# Altium schematic sheet ESC_2S-5S.SchDoc: Brushless motor driver
size A4; Organization: Use Organization_Name in ProjParam; Address1: Eliot Ferragni; Address2: STI-MOBOTS; Address3: EPFL; Address4: CH-1015 LAUSANNE; DocumentNumber: 5; Revision: A; SheetNumber: 5; SheetTotal: 11; ApprovedBy: Init ApprovedBy in DocParam; CheckedBy: Init CheckedBy in DocParam; Author: Init Author in DocParam; CompanyName: Init CompanyName in DocParam; DrawnBy: Init DrawBy in DocParam; Engineer: Init Engineer in DocParam; Title2: Half-bridges + phase sense circuit + connector; DocumentName: Init DocumentName in DocParam; ProjectName: Init ProjectName in DocParam
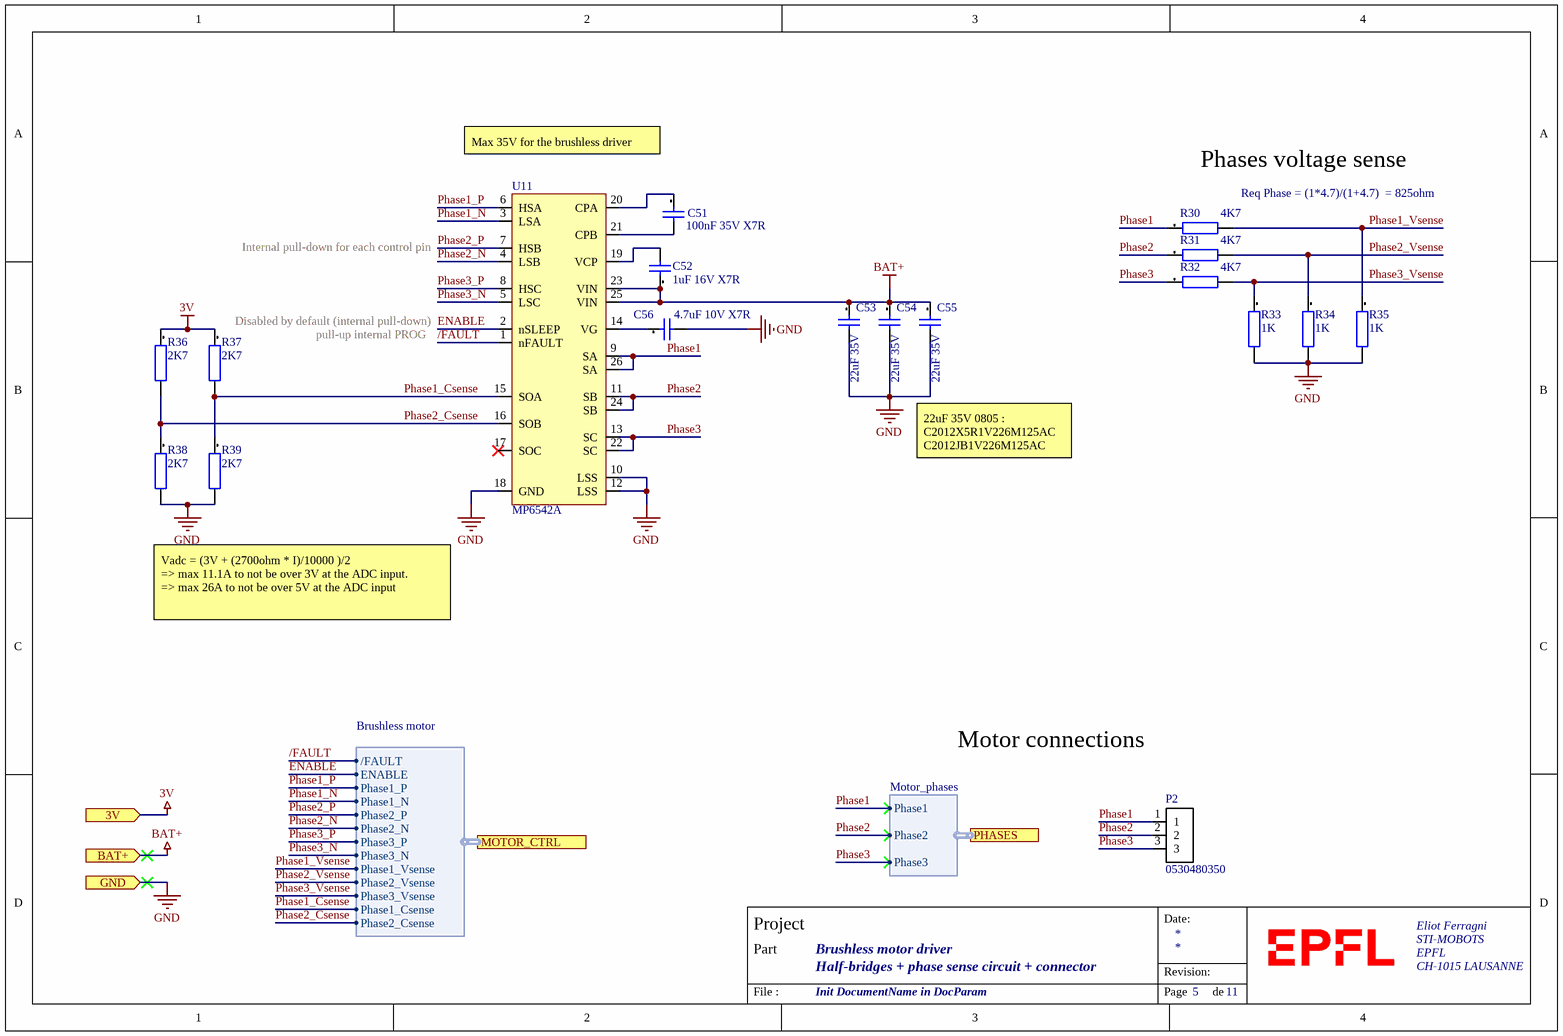
[diagram p0: ESC_2S-5S.SchDoc]

## Parts
C51  100nF 35V X7R  [CAPC1005X05L]
C52  1uF 16V X7R  [CAPC1608X08L]
C53  22uF 35V  [CAPC2012X13L]
C54  22uF 35V  [CAPC2012X13L]
C55  22uF 35V  [CAPC2012X13L]
C56  4.7uF 10V X7R  [CAPC2012X13L]
P2  0530480350  [0530480350]
R30  4K7  [RESC0201(0603)_L]
R31  4K7  [RESC0201(0603)_L]
R32  4K7  [RESC0201(0603)_L]
R33  1K  [RESC0201(0603)_L]
R34  1K  [RESC0201(0603)_L]
R35  1K  [RESC0201(0603)_L]
R36  2K7  [RESC0201(0603)_L]
R37  2K7  [RESC0201(0603)_L]
R38  2K7  [RESC0201(0603)_L]
R39  2K7  [RESC0201(0603)_L]
U11  MP6542A  [FCQFN6x6-26]

## Ports
3V (in), BAT+ (in), GND (in), MOTOR_CTRL (harness Brushless motor), PHASES (harness Motor_phases)

## Harnesses
Brushless motor: Phase1_P, Phase1_N, Phase2_P, Phase2_N, Phase3_P, Phase3_N, Phase1_Vsense, Phase2_Vsense, Phase3_Vsense, Phase1_Csense, ENABLE, /FAULT, Phase2_Csense
Motor_phases: Phase1, Phase2, Phase3

## Nets
3V: R36.1 R37.1 ; port 3V
BAT+: C52.1 C53.1 C54.1 C55.1 U11.23(VIN) U11.25(VIN) ; port BAT+
GND: C53.2 C54.2 C55.2 C56.2 R33.2 R34.2 R35.2 R38.2 R39.2 U11.10(LSS) U11.12(LSS) U11.18(GND) ; port GND
/FAULT: U11.1(nFAULT) ; port MOTOR_CTRL./FAULT
ENABLE: U11.2(nSLEEP) ; port MOTOR_CTRL.ENABLE
Phase1: P2.1 R30.1 U11.9(SA) U11.26(SA) ; port PHASES.Phase1
Phase1_Csense: R37.2 R39.1 U11.15(SOA) ; port MOTOR_CTRL.Phase1_Csense
Phase1_N: U11.3(LSA) ; port MOTOR_CTRL.Phase1_N
Phase1_P: U11.6(HSA) ; port MOTOR_CTRL.Phase1_P
Phase1_Vsense: R30.2 R35.1 ; port MOTOR_CTRL.Phase1_Vsense
Phase2: P2.2 R31.1 U11.11(SB) U11.24(SB) ; port PHASES.Phase2
Phase2_Csense: R36.2 R38.1 U11.16(SOB) ; port MOTOR_CTRL.Phase2_Csense
Phase2_N: U11.4(LSB) ; port MOTOR_CTRL.Phase2_N
Phase2_P: U11.7(HSB) ; port MOTOR_CTRL.Phase2_P
Phase2_Vsense: R31.2 R34.1 ; port MOTOR_CTRL.Phase2_Vsense
Phase3: P2.3 R32.1 U11.13(SC) U11.22(SC) ; port PHASES.Phase3
Phase3_N: U11.5(LSC) ; port MOTOR_CTRL.Phase3_N
Phase3_P: U11.8(HSC) ; port MOTOR_CTRL.Phase3_P
Phase3_Vsense: R32.2 R33.1 ; port MOTOR_CTRL.Phase3_Vsense
NetC51_1: C51.1 U11.20(CPA)
NetC51_2: C51.2 U11.21(CPB)
NetC52_2: C52.2 U11.19(VCP)
NetC56_1: C56.1 U11.14(VG)

Not connected (* = marked no-connect by the designer): U11 17(SOC)*

## Notes on the sheet
- Max 35V for the brushless driver
- Phases voltage sense
- (near U11) Internal pull-down for each control pin
- (near R30) Req Phase = (1*4.7)/(1+4.7)  = 825ohm
- Disabled by default (internal pull-down)
- pull-up internal PROG
- 22uF 35V 0805 :
  C2012X5R1V226M125AC
  C2012JB1V226M125AC
- Vadc = (3V + (2700ohm * I)/10000 )/2
  => max 11.1A to not be over 3V at the ADC input.
  => max 26A to not be over 5V at the ADC input
- Motor connections
- Date:
- Project
- Part
- Revision:
- File :
- Page
- de

## Library data of the parts
C51 = TBD Capacitor[[/\]]0402[[/\]]1: Capacitor 0402; Preference: 1; Currentie: CHF; Type: SMD; Note: To buy by assembler; Size: 0402; Footprint Acort: 0402; ROHS: True; DateLastUpdate: 2012-11-19 / 14:35:51; Manufacturer: -; Manufacturer part number: -; Package / Case: Capacitor 0402
C52 = TBD Capacitor[[/\]]0603[[/\]]1: Capacitor 0603; Preference: 1; Currentie: CHF; Type: SMD; Note: To buy by assembler; Size: 0603; Footprint Acort: 0603_G; ROHS: True; DateLastUpdate: 2012-11-19 / 14:36:40; Manufacturer: -; Manufacturer part number: -; Package / Case: Capacitor 0603
C53-C55 = TBD Capacitor[[/\]]0805[[/\]]1: Capacitor 0805; Manufacturer: TDK; Manufacturer part number: C2012X5R1V226M125AC; Preference: 1; Currentie: CHF; Type: SMD; Note: To buy by assembler; Size: 0805; Footprint Acort: 0805_G; ROHS: True; DateLastUpdate: 2012-11-19 / 14:37:26; Package / Case: Capacitor 0805
C56 = TBD Capacitor[[/\]]0805[[/\]]1: Capacitor 0805; Preference: 1; Currentie: CHF; Type: SMD; Note: To buy by assembler; Size: 0805; Footprint Acort: 0805_G; ROHS: True; DateLastUpdate: 2012-11-19 / 14:37:26; Manufacturer: -; Manufacturer part number: -; Package / Case: Capacitor 0805
P2 = 0530480350: CONN HEADER 3POS 1.25MM R/A TIN; Manufacturer: Molex; Supplier 1: Digi-Key; Stock 1: 19832; Pricing 1: 1 = 0,61000, 10 = 0,56900, 100 = 0,43590, 500 = 0,37900, 2500 = 0,28425, 5000 = 0,27478, 10000 = 0,25583 (USD); RoHS: No; Supplier Part Number 1: 0530480350-ND; Manufacturer Part Number: 0530480350
R30-R39 = TBD[[/\]]0201[[/\]]1: Resistor 0201; Preference: 1; Currentie: CHF; Note: To buy by assembler; Size: 0201; Footprint Acort: 0201; ROHS: True; DateLastUpdate: 2018-10-19 / 9:06:49 AM; Type: SMD; Manufacturer: -; Manufacturer part number: -; Package / Case: Resistor 0201
U11 = MP6542A: 11A integrated 3 half-bridges for brushless motor; Manufacturer: Monolithic Power Systems; Note: Provided by Customer; Manufacturer Part Number: MP6542A; Type: SMD; Package / Case: QFN-26